# EAGLE schematic PANEL_2 (EAGLE 7.5.0)
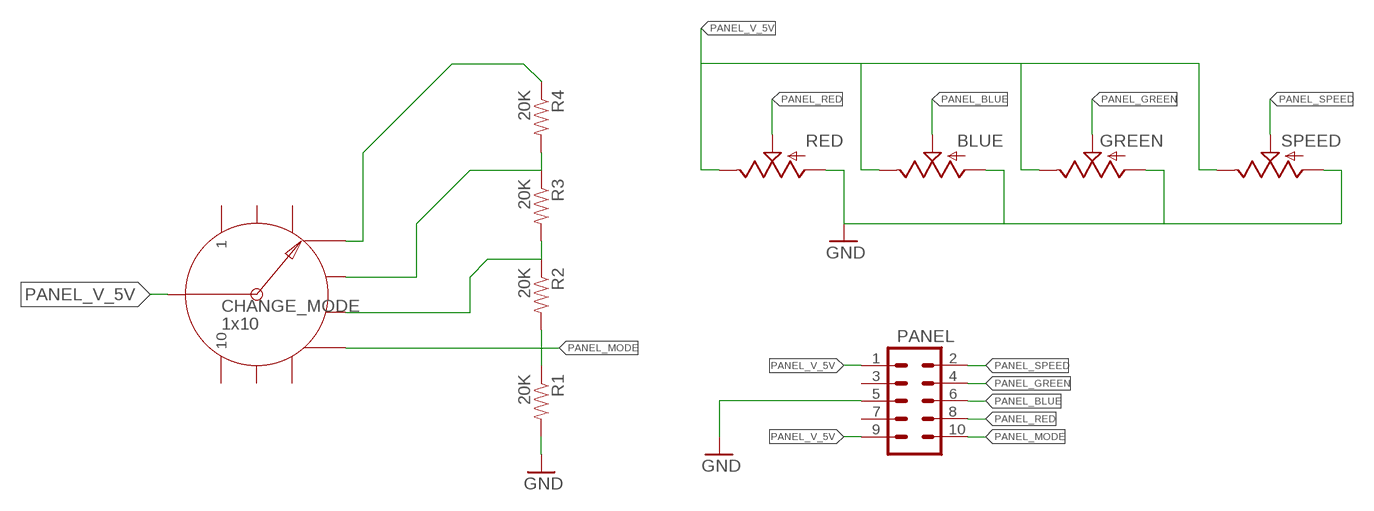
[diagram p0: schematic, sheet 1]

## Parts
BLUE  POT-RV16AF-20  [POT_ALPHA_RV16AF-20]
CHANGE_MODE  1x10  SWITCH_ROTARY_1X10  [ROTARY_SWITCH_1X10]
GREEN  POT-RV16AF-20  [POT_ALPHA_RV16AF-20]
PANEL  M05X2SHD  [2X5-SHROUDED]
R1  20K  RESISTOREZ  [AXIAL-0.3EZ]
R2  20K  RESISTOREZ  [AXIAL-0.3EZ]
R3  20K  RESISTOREZ  [AXIAL-0.3EZ]
R4  20K  RESISTOREZ  [AXIAL-0.3EZ]
RED  POT-RV16AF-20  [POT_ALPHA_RV16AF-20]
SPEED  POT-RV16AF-20  [POT_ALPHA_RV16AF-20]

## Nets
GND: BLUE.1(A) GREEN.1(A) PANEL.5 R1.P$2 RED.1(A) SPEED.1(A)
N$2: CHANGE_MODE.4 R4.P$1
N$3: CHANGE_MODE.5 R3.P$1 R4.P$2
N$4: CHANGE_MODE.6 R2.P$1 R3.P$2
PANEL_BLUE: BLUE.2(S) PANEL.6
PANEL_GREEN: GREEN.2(S) PANEL.4
PANEL_MODE: CHANGE_MODE.7 PANEL.10 R1.P$1 R2.P$2
PANEL_RED: PANEL.8 RED.2(S)
PANEL_SPEED: PANEL.2 SPEED.2(S)
PANEL_V_5V: BLUE.3(E) CHANGE_MODE.COMMON GREEN.3(E) PANEL.1 PANEL.9 RED.3(E) SPEED.3(E)
Unconnected: CHANGE_MODE.1 CHANGE_MODE.2 CHANGE_MODE.3 CHANGE_MODE.8 CHANGE_MODE.9 CHANGE_MODE.10 PANEL.3 PANEL.7

## Library data of the parts
BLUE GREEN RED SPEED = SparkFun-Electromechanical:POT
CHANGE_MODE = SparkFun-Electromechanical:SWITCH_ROTARY_1X10: SWCH-12120; PROD_ID: SWCH-12120
PANEL = SparkFun-Connectors:M05X2: Header 5x2 Standard 10-pin dual row 0.1" header. Commonly used with AVR-ISP. Use with Spark Fun Electronics SKU: PRT-00778
R1-R4 = SparkFun-Passives:RESISTOR: Resistor Basic schematic elements and footprints for 0603, 1206, and PTH resistors.

## Net classes
0 default: width 0.254 mm